# EAGLE design board (EAGLE 8.3.1)
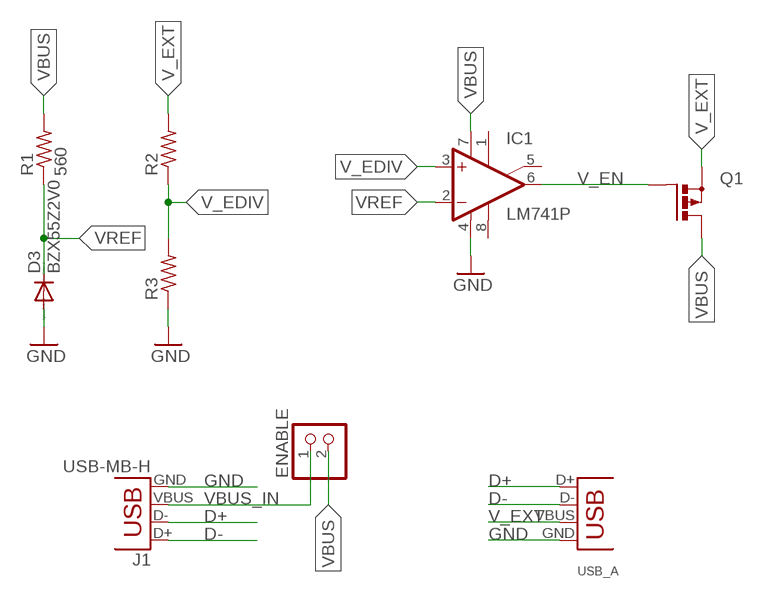
[diagram p0: schematic, sheet 1]

## Parts
D3  BZX55Z2V0  1N4148DO35-7  [DO35-7]
ENABLE  PINHD-1X2  [1X02]
IC1  LM741P  [DIL08]
J1  USB-MB-H  [USB-MB-H]
Q1  PMOSFET_PTO220BV  [TO220BV]
R1  560  R-US_0207/7  [0207/7]
R2  R-US_0207/7  [0207/7]
R3  R-US_0207/7  [0207/7]
USB_A  USB-A-H  [USB-A-H]

## Nets
D+: J1.D- USB_A.D+
D-: J1.D+ USB_A.D-
GND: D3.A IC1.4(V-) J1.GND R3.1 USB_A.GND
V_EDIV: IC1.3(+IN) R2.1 R3.2
V_EN: IC1.6(OUT) Q1.G
V_EXT: Q1.S R2.2 USB_A.VBUS
VBUS: ENABLE.2 IC1.7(V+) Q1.D R1.2
VBUS_IN: ENABLE.1 J1.VBUS
VREF: D3.C IC1.2(-IN) R1.1
Unconnected: IC1.1(ON1) IC1.5(ON2) IC1.8(OPT)

## Library data of the parts
D3 = diode:1N4148: DIODE high speed (Philips)
ENABLE = pinhead:PINHD-1X2: PIN HEADER
IC1 = linear:*741: OP AMP
J1 = SparkFun-Retired:USB: USB Connectors USB-B-PTH is fully proven SKU : PRT-00139/CONN-08278 USB-miniB is fully proven SKU : PRT-00587 USB-A-PCB is untested. USB-A-H is throughly reviewed, but untested. Spark Fun Electronics SKU : PRT-00437 USB-B-SMT is throughly reviewed, but untested. Needs silkscreen touching up. USB-A-S has not been used/tested USB-MB-H has not been used/tested USB-MICROB has been used. CONN-09505
Q1 = transistor-power:PMOSFET_P: Power MOSFET P-Channel
R1-R3 = resistor:R-US_: RESISTOR, American symbol
USB_A = con-usb-3:USB: USB Connectors USB-B-PTH is fully proven SKU : PRT-00139/CONN-08278 USB-miniB is fully proven SKU : PRT-00587 USB-A-PCB is untested. USB-A-H is throughly reviewed, but untested. Spark Fun Electronics SKU : PRT-00437 USB-B-SMT is throughly reviewed, but untested. Needs silkscreen touching up. USB-A-S has not been used/tested USB-MB-H has not been used/tested USB-MICROB has been used. CONN-09505

## Board
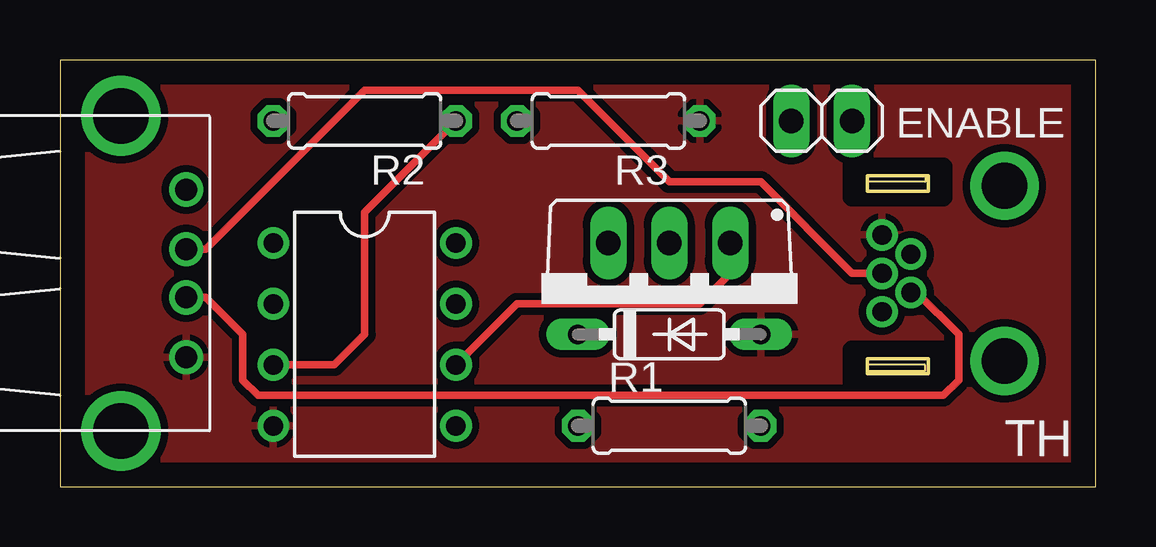
[diagram p1: board, top side]
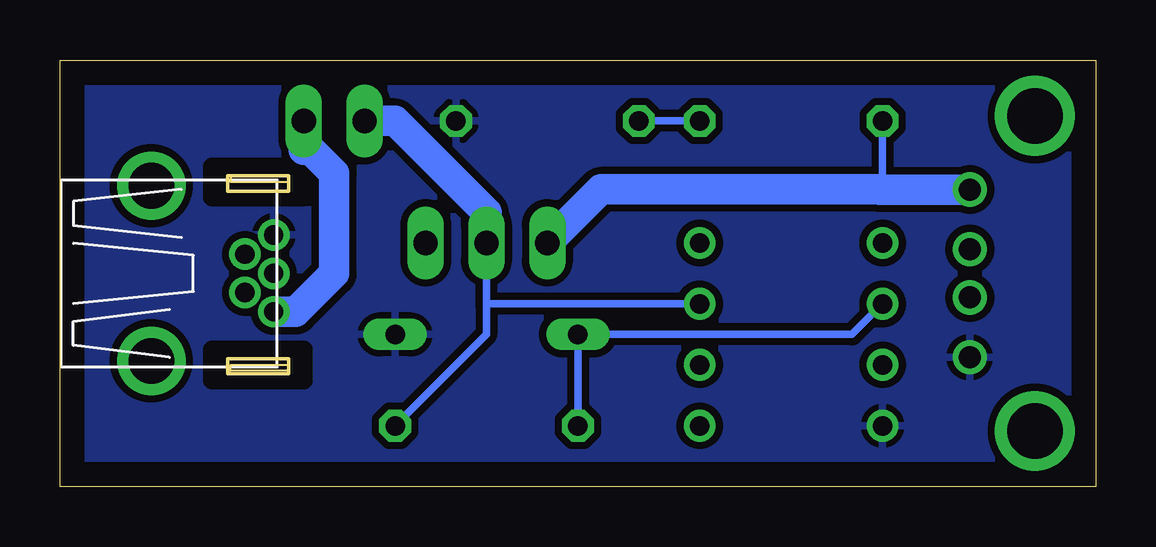
[diagram p2: board, bottom side, seen from below]

Size 43.18 x 17.78 mm. Coordinates in mm from the lower left corner, seen from the top.
Outline: 0,0 43.18,0 43.18,17.78 0,17.78 0,0
Copper layers (1*16): Top 0.035mm / dielectric 1.5mm / Bottom 0.035mm
Design rules "default": minimum track width 6mil, minimum drill 0.35mm, track to track 6mil, track to pad 6mil, pad to pad 6mil, via to via 6mil, smd to smd 6mil, copper to edge 40mil, drill to drill 6mil, minimum pad ring 10mil, minimum via ring 8mil, stop-mask expansion 4mil, vias tented up to drill 0mil, thermal gap 10mil
tRestrict: area 33,4.4 to 36.8,5.7; area 33,12.1 to 36.8,13.3
bRestrict: area 33,12.1 to 36.8,13.3; area 33,4.4 to 36.8,5.7
Milling: area 33.7,12.7 to 36.1,13; area 33.7,4.8 to 36.1,5.1; area 33.7,12.3 to 36.2,13; area 33.7,4.7 to 36.2,5.3

### Footprints (pad centres in the part's own frame; a part is rotated, then mirrored left to right if it is on the bottom)
DO35-7 = drill 0.813 long: A 3.81,0; C -3.81,0
1X02 = drill 1.016 long: 1 -1.27,0; 2 1.27,0
DIL08 = drill 0.813 pad 1.27: 1 -3.81,-3.81; 2 -1.27,-3.81; 3 1.27,-3.81; 4 3.81,-3.81; 5 3.81,3.81; 6 1.27,3.81; 7 -1.27,3.81; 8 -3.81,3.81
USB-MB-H = drill 0.8: D+ 5.1,0; D- 3.9,0.8; GND 5.1,-1.6; ID 3.9,-0.8; VBUS 5.1,1.6 | drill 1.9: P$6 0,-3.65; P$7 0,3.65
TO220BV = drill 1.016 long: D 0,-2.54; G -2.54,-2.54; S 2.54,-2.54
0207/7 = drill 0.813 octagon: 1 -3.81,0; 2 3.81,0
USB-A-H = drill 0.914: D+ 2.718,-1.003; D- 2.718,1.003; GND 2.718,-3.493; VBUS 2.718,3.493 | drill 2.311: P$5 0,-6.566; P$6 0,6.566

### Placement (x,y rotation side)
D3  25.4,6.35 0 top
ENABLE  31.75,15.24 180 top
IC1  12.7,6.35 270 top
J1  39.37,8.89 180 top
Q1  25.4,7.62 180 top
R1  25.4,2.54 0 top
R2  12.7,15.24 180 top
R3  22.86,15.24 180 top
USB_A  2.54,8.89 0 top

### Tracks (layer width: path | path; a pad name or v marks a point on that pad's centre or on a via)
D+
  Top 0.305: J1.D- 35.72,8.09 37.47,6.35 37.47,4.44 36.83,3.81 8.25,3.81 7.62,4.44 7.62,6.35 6.08,7.89 USB_A.D+
D-
  Top 0.305: J1.D+ 33.02,8.89 29.21,12.7 25.4,12.7 21.59,16.51 12.7,16.51 6.08,9.89 USB_A.D-
GND
  pour Bottom (isolate 0.305): 0,17.78 0,0 43.18,0 43.18,17.78
  pour Top (isolate 0.305): 0,17.78 0,0 43.18,0 43.18,17.78
V_EDIV
  Top 0.305: IC1.3 11.43,5.08 12.7,6.35 12.7,11.43 R2.1
  Bottom 0.305: R2.1 R3.2
V_EN
  Top 0.305: IC1.6 19.05,7.62 26.67,7.62 27.94,8.89 Q1.G
V_EXT
  Bottom 0.305: R2.2 8.89,12.53 9.03,12.39
  Bottom 1.27: Q1.S 20.63,12.39 9.03,12.39 9.02,12.38 USB_A.VBUS
VBUS
  Bottom 0.305: 25.4,7.58 Q1.D | 25.4,7.58 25.4,6.35 R1.2 | IC1.7 25.36,7.62 25.4,7.58
  Bottom 1.27: Q1.D 25.4,11.43 29.21,15.24 ENABLE.2
VBUS_IN
  Bottom 1.27: J1.VBUS 33.35,7.29 31.75,8.89 31.75,13.07 32.72,14.05 33.02,14.05 ENABLE.1
VREF
  Bottom 0.305: R1.1 D3.C 10.16,6.35 IC1.2

### Text on the board
_tsilk: TH